# Altium schematic sheet design_10.SchDoc: design
size 414 x 279 mm; Date: 1/25/2021 11:39:22 PM; SheetNumber: 11; Origin: Eagle; GateName_1: G$1; SymbolName_1: A3-L-GUMSTIX; LibraryName: qualified_1; DeviceSetName: A3-L-GUMSTIX; A: A; B: B; C: C; D: D; E: E; F: F; G: G; H: H; 1: 1; 2: 2; 3: 3; 4: 4; 5: 5; Sheet: Sheet:; C:/Gumstix/gumstix-logo-16.bmp: C:/Gumstix/gumstix-logo-16.bmp; Board: Board:
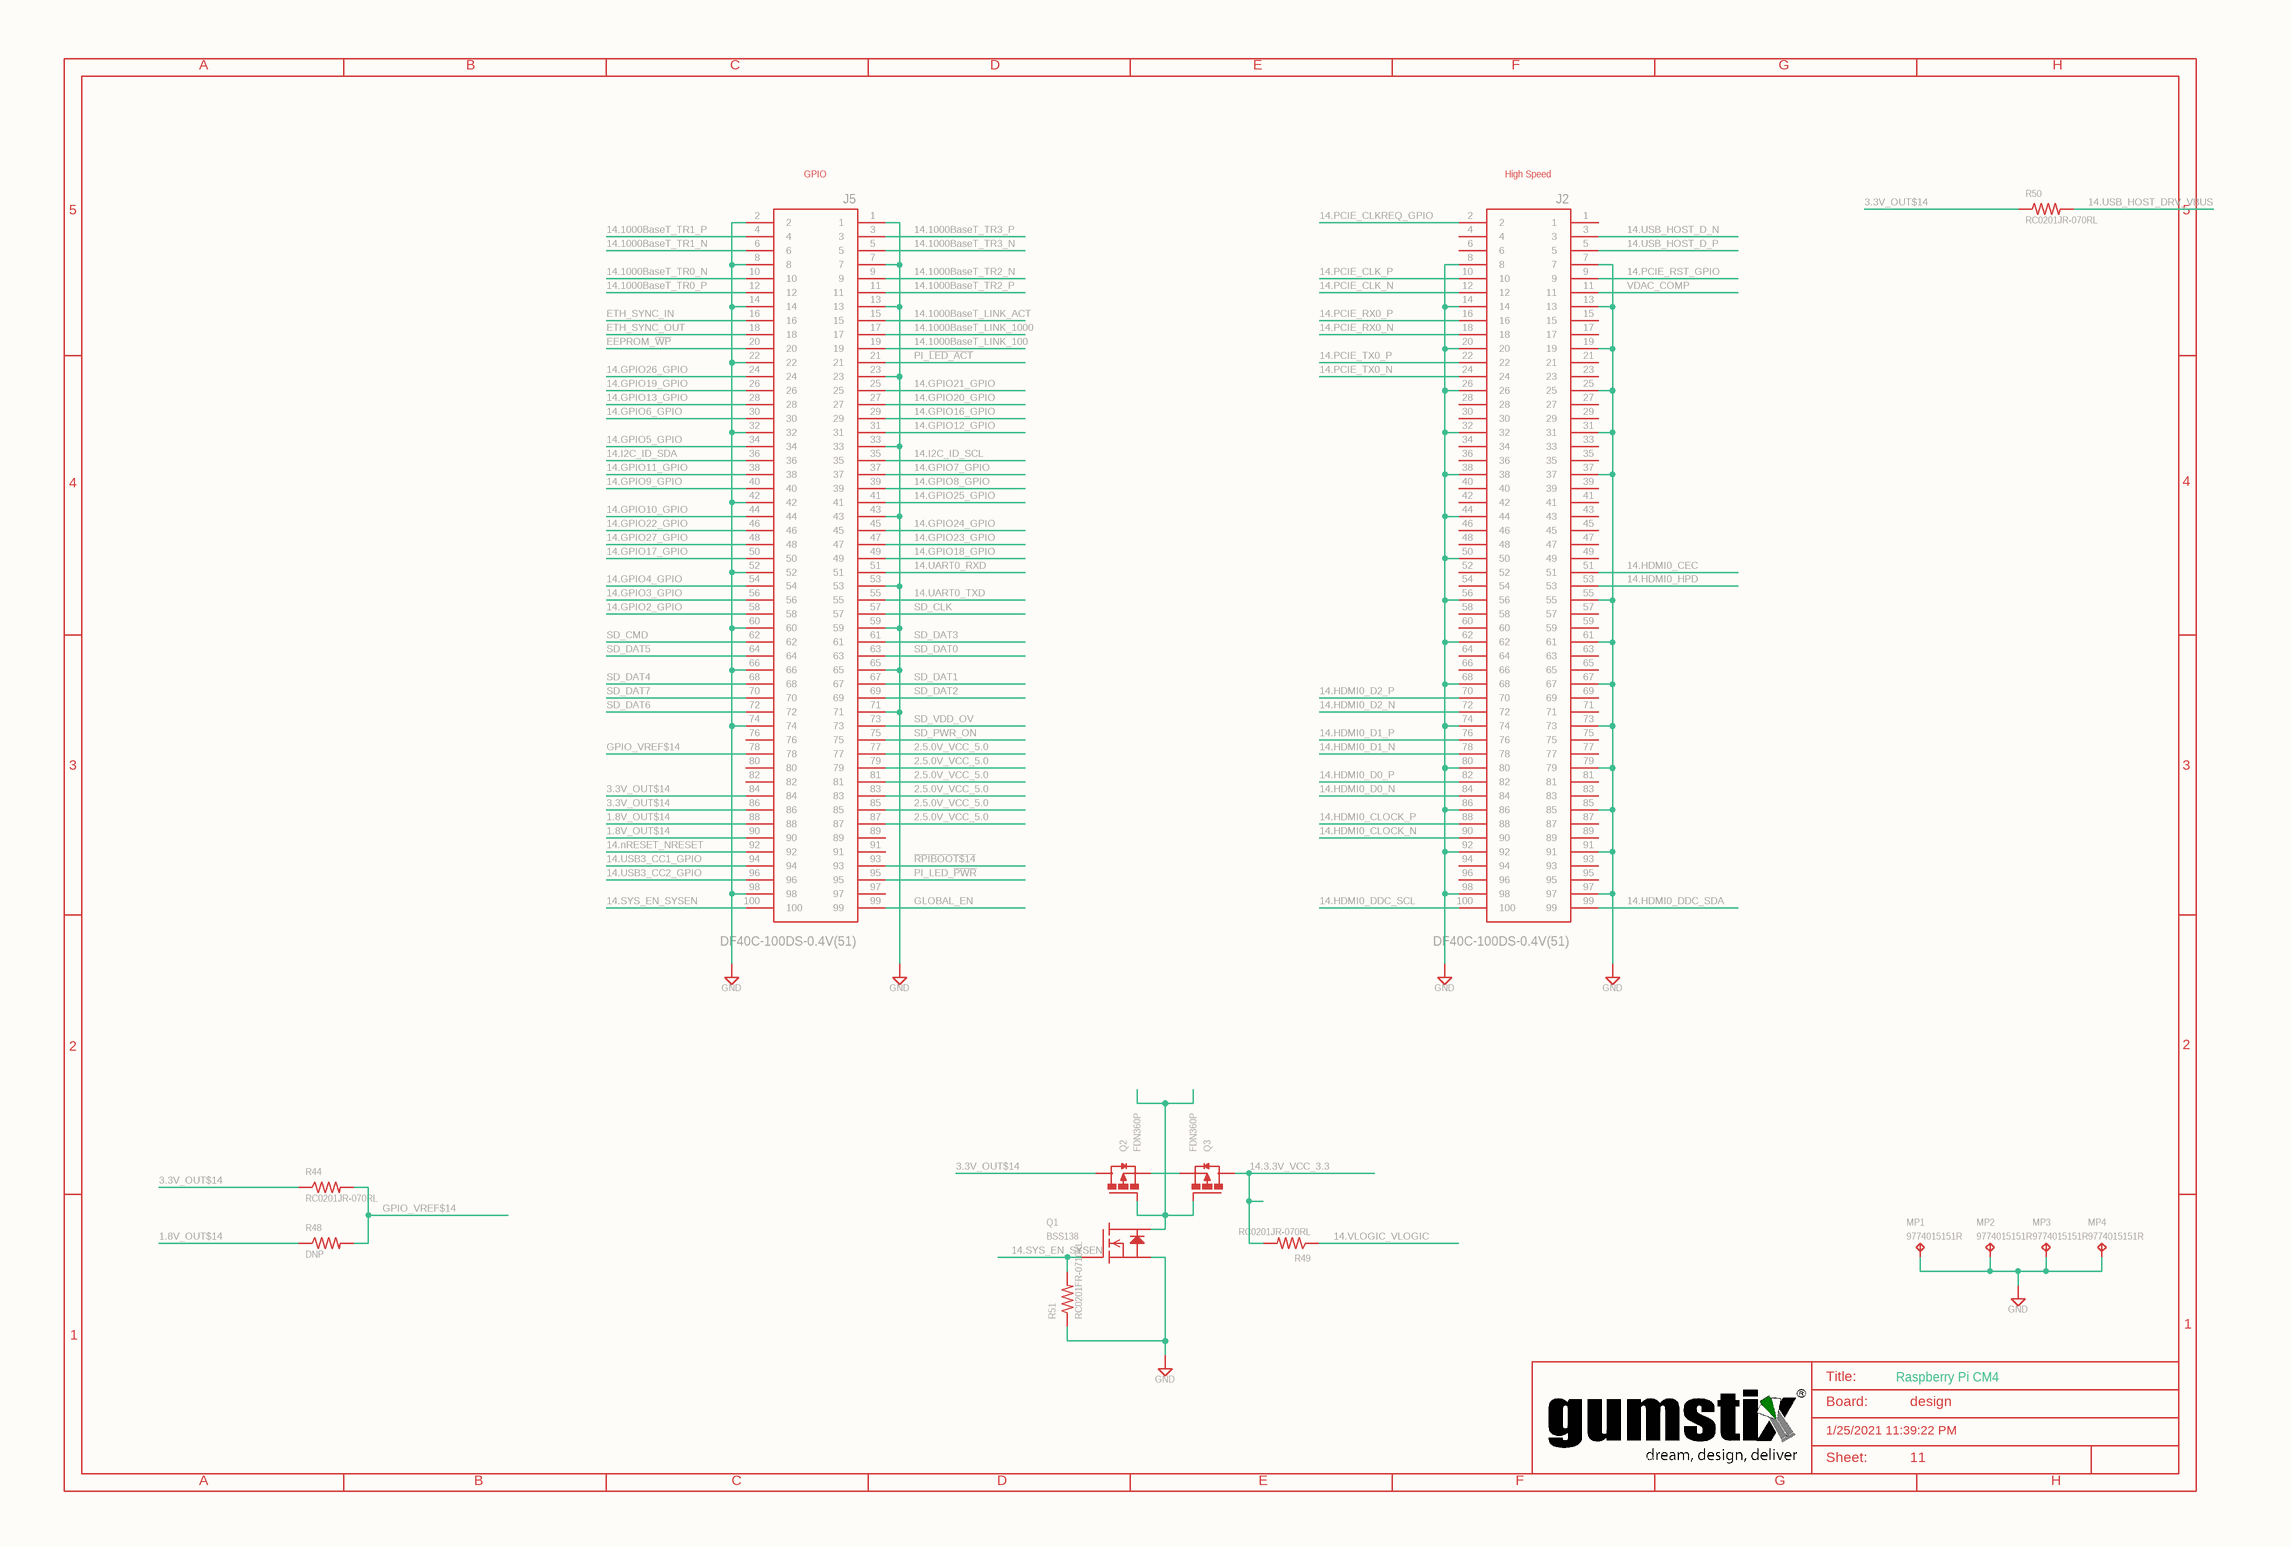
[diagram p0: design_10.SchDoc]

## Parts
J2  DF40C-100DS-0.4V(51)  [HRS_DF40C-100DS-0.4V(51)]
J5  DF40C-100DS-0.4V(51)  [HRS_DF40C-100DS-0.4V(51)]
MP1  9774015151R  [WA-SMSI_9774___151]
MP2  9774015151R  [WA-SMSI_9774___151]
MP3  9774015151R  [WA-SMSI_9774___151]
MP4  9774015151R  [WA-SMSI_9774___151]
Q1  BSS138  [SOT23]
Q2  FDN360P  [SOT23]
Q3  FDN360P  [SOT23]
R44  RC0201JR-070RL  [0201]
R48  DNP  [0201]
R49  RC0201JR-070RL  [0201]
R50  RC0201JR-070RL  [0201]
R51  RC0201FR-0710KL  [0201]
SUPPLY120  GND
SUPPLY121  GND
SUPPLY122  GND
SUPPLY126  GND
SUPPLY127  GND
SUPPLY130  GND

## Nets
1.8V_OUT$14: J5.88 J5.90 R48.1
2.5.0V_VCC_5.0: J5.77 J5.79 J5.81 J5.83 J5.85 J5.87
3.3V_OUT$14: J5.84 J5.86 Q2.3(D) R44.1 R50.1
14.3.3V_VCC_3.3: Q3.3(D) R49.2
14.1000BaseT_LINK_100: J5.19
14.1000BaseT_LINK_1000: J5.17
14.1000BaseT_LINK_ACT: J5.15
14.1000BaseT_TR0_N: J5.10
14.1000BaseT_TR0_P: J5.12
14.1000BaseT_TR1_N: J5.6
14.1000BaseT_TR1_P: J5.4
14.1000BaseT_TR2_N: J5.9
14.1000BaseT_TR2_P: J5.11
14.1000BaseT_TR3_N: J5.5
14.1000BaseT_TR3_P: J5.3
14.GPIO2_GPIO: J5.58
14.GPIO3_GPIO: J5.56
14.GPIO4_GPIO: J5.54
14.GPIO5_GPIO: J5.34
14.GPIO6_GPIO: J5.30
14.GPIO7_GPIO: J5.37
14.GPIO8_GPIO: J5.39
14.GPIO9_GPIO: J5.40
14.GPIO10_GPIO: J5.44
14.GPIO11_GPIO: J5.38
14.GPIO12_GPIO: J5.31
14.GPIO13_GPIO: J5.28
14.GPIO16_GPIO: J5.29
14.GPIO17_GPIO: J5.50
14.GPIO18_GPIO: J5.49
14.GPIO19_GPIO: J5.26
14.GPIO20_GPIO: J5.27
14.GPIO21_GPIO: J5.25
14.GPIO22_GPIO: J5.46
14.GPIO23_GPIO: J5.47
14.GPIO24_GPIO: J5.45
14.GPIO25_GPIO: J5.41
14.GPIO26_GPIO: J5.24
14.GPIO27_GPIO: J5.48
14.HDMI0_CEC: J2.51
14.HDMI0_CLOCK_N: J2.90
14.HDMI0_CLOCK_P: J2.88
14.HDMI0_D0_N: J2.84
14.HDMI0_D0_P: J2.82
14.HDMI0_D1_N: J2.78
14.HDMI0_D1_P: J2.76
14.HDMI0_D2_N: J2.72
14.HDMI0_D2_P: J2.70
14.HDMI0_DDC_SCL: J2.100
14.HDMI0_DDC_SDA: J2.99
14.HDMI0_HPD: J2.53
14.I2C_ID_SCL: J5.35
14.I2C_ID_SDA: J5.36
14.nRESET_NRESET: J5.92
14.PCIE_CLK_N: J2.12
14.PCIE_CLK_P: J2.10
14.PCIE_CLKREQ_GPIO: J2.2
14.PCIE_RST_GPIO: J2.9
14.PCIE_RX0_N: J2.18
14.PCIE_RX0_P: J2.16
14.PCIE_TX0_N: J2.24
14.PCIE_TX0_P: J2.22
14.SYS_EN_SYSEN: J5.100 Q1.1(G) R51.2
14.UART0_RXD: J5.51
14.UART0_TXD: J5.55
14.USB3_CC1_GPIO: J5.94
14.USB3_CC2_GPIO: J5.96
14.USB_HOST_D_N: J2.3
14.USB_HOST_D_P: J2.5
14.USB_HOST_DRV_VBUS: R50.2
14.VLOGIC_VLOGIC: R49.1
EEPROM_~{WP}: J5.20
ETH_SYNC_IN: J5.16
ETH_SYNC_OUT: J5.18
GLOBAL_EN: J5.99
GPIO_VREF$14: J5.78 R44.2 R48.2
PI_~{LED_ACT}: J5.21
PI_LED_~{PWR}: J5.95
~{RPIBOOT$14}: J5.93
SD_CLK: J5.57
SD_CMD: J5.62
SD_DAT0: J5.63
SD_DAT1: J5.67
SD_DAT2: J5.69
SD_DAT3: J5.61
SD_DAT4: J5.68
SD_DAT5: J5.64
SD_DAT6: J5.72
SD_DAT7: J5.70
SD_PWR_ON: J5.75
SD_VDD_OV: J5.73
VDAC_COMP: J2.11
NetJ2_7: J2.7 J2.13 J2.19 J2.25 J2.31 J2.37 J2.55 J2.61 J2.67 J2.73 J2.79 J2.85 J2.91 J2.97 SUPPLY121.?1(GND)
NetJ2_8: J2.8 J2.14 J2.20 J2.26 J2.32 J2.38 J2.44 J2.50 J2.56 J2.62 J2.68 J2.74 J2.80 J2.86 J2.92 J2.98 SUPPLY127.?1(GND)
NetJ5_1: J5.1 J5.7 J5.13 J5.23 J5.33 J5.43 J5.53 J5.59 J5.65 J5.71 SUPPLY126.?1(GND)
NetJ5_2: J5.2 J5.8 J5.14 J5.22 J5.32 J5.42 J5.52 J5.60 J5.66 J5.74 J5.98 SUPPLY120.?1(GND)
NetMP1_1: MP1.1(TP) MP2.1(TP) MP3.1(TP) MP4.1(TP) SUPPLY122.?1(GND)
NetQ1_2: Q1.2(S) R51.1 SUPPLY130.?1(GND)
NetQ1_3: Q1.3(D) Q2.1(G) Q3.1(G)
NetQ2_2: Q2.2(S) Q3.2(S)

Not connected (* = marked no-connect by the designer): J2 1 4 6 15 17 21 23 27 28 29 30 33 34 35 36 39 40 41 42 43 45 46 47 48 49 52 54 57 58 59 60 63 64 65 66 69 71 75 77 81 83 87 89 93 94 95 96; J5 76 80 82 89 91 97

## Notes on the sheet
- A
- B
- C
- D
- E
- F
- G
- H
- 5
- (near J5) GPIO
- (near J2) High Speed
- 4
- 3
- 2
- 1
- Title:
- Board:
- Raspberry Pi CM4
- design
- C:/Gumstix/gumstix-logo-16.bmp
- 1/25/2021 11:39:22 PM
- Sheet:
- 11

## Library data of the parts
J2 J5 = DF40C-100DS-0.4V(51): DF40 Series 100 Position Dual Row 0.4 mm Pitch Surface Mount Vertical Receptacle; GateName_1: G$1; MF: Hirose; MP: DF40C-100DS-0.4V_51_; SymbolName_1: DF40C-100DS-0.4V(51); LibraryName: qualified_1; DeviceSetName: DF40C-100DS-0.4V(51); DIGI-KEY_PART_NUMBER: H11615CT-ND; DIGI-KEY_PURCHASE_URL: https://www.digikey.ca/product-detail/en/hirose-electric-co-ltd/DF40C-100DS-0.4V_51_/H11615CT-ND/1969495?utm_source=snapeda&utm_medium=aggregator&utm_campaign=symbol; PACKAGE: None
MP1-MP4 = 9774015151R: Bullet connector (for RC) solder pad.; GateName_1: G$1; SymbolName_1: TP; LibraryName: qualified_1; DeviceSetName: 9774015151R
Q1 = BSS138: N-Channel Enhancement MOSFET; GateName_1: G$1; SymbolName_1: IGFET-EN-GDS; LibraryName: qualified_1; DeviceSetName: BSS138; HEIGHT: 1.12
Q2 Q3 = FDN360P: GateName_1: G$1; SymbolName_1: MOSFET_P_ENH; LibraryName: qualified_1; DeviceSetName: FDN360P; D: D; S: S; G: G; HEIGHT: 1.12
R44 R49 R50 = RC0201JR-070RL: GateName_1: G$1; SymbolName_1: R-US; LibraryName: qualified_1; DeviceSetName: RC0201JR-070RL; HEIGHT: 0.25
R48 = R0201: GateName_1: G$1; SymbolName_1: R-US; DeviceSetName: R; DeviceName: 0201; LibraryName: qualified_1; HEIGHT: 0.25
R51 = RC0201FR-0710KL: GateName_1: G$1; SymbolName_1: R-US; LibraryName: qualified_1; DeviceSetName: RC0201FR-0710KL; HEIGHT: 0.25
SUPPLY120-SUPPLY122 SUPPLY126 SUPPLY127 SUPPLY130 = GND: SUPPLY SYMBOL; SymbolName_1: GND-2; GateName_1: GND; LibraryName: qualified_1; DeviceSetName: GND